# EAGLE design pneumatic-reg - 40PC Sensor (EAGLE 7.6.0)
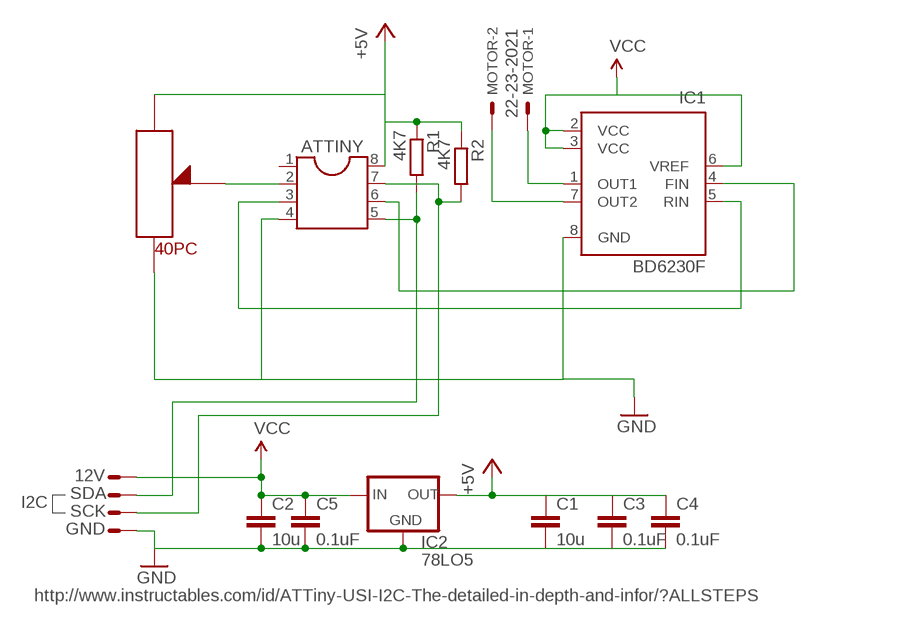
[diagram p0: schematic, sheet 1]

## Parts
ATTINY  DIL8  [DIL08]
C1  10u  C-EUC1206  [C1206]
C2  10u  C-EUC1206  [C1206]
C3  0.1uF  C-EUC1206  [C1206]
C4  0.1uF  C-EUC1206  [C1206]
C5  0.1uF  C-EUC1206  [C1206]
IC1  BD6230F  [SOP8]
IC2  78LO5  78LXX  [78LXX]
MOTOR  22-23-2021  [22-23-2021]
R1  4K7  R-EU_M0805  [M0805]
R2  4K7  R-EU_M0805  [M0805]
U$1  40PC  [40PC]
X2  22-23-2041  [22-23-2041]

## Nets
+5V: ATTINY.8 C1.1 C3.1 C4.1 IC2.OUT R1.1 R2.1 U$1.PIN1
D0: ATTINY.3 IC1.5(RIN)
D1: ATTINY.6 IC1.4(FIN)
GND: ATTINY.4 C1.2 C2.2 C3.2 C4.2 C5.2 IC1.8(GND) IC2.GND U$1.PIN2 X2.1
N$1: ATTINY.2 U$1.PIN3
N$3: ATTINY.5 R1.2 X2.3
N$4: IC1.7(OUT2) MOTOR.2
N$5: IC1.1(OUT1) MOTOR.1
N$9: ATTINY.7 R2.2 X2.2
VCC: C2.1 C5.1 IC1.2(VCC) IC1.3(VCC) IC1.6(VREF) IC2.IN X2.4
Unconnected: ATTINY.1

## Notes on the sheet
- 12V
- SDA
- I2C
- SCK
- GND
- http://www.instructables.com/id/ATTiny-USI-I2C-The-detailed-in-depth-and-infor/?ALLSTEPS

## Library data of the parts
ATTINY = ic-package:DIL8: Dual In Line / Socket
C1-C5 = rcl:C-EU: CAPACITOR, European symbol
IC1 = rohm:BD623*F: H-bridge driver for brush motors Source: http://www.rohm.com/products/databook/motor/pdf/bd623x_series-e.pdf; MPN: BD6230F-E2; OC_FARNELL: 1716264; OC_NEWARK: 15R0529
IC2 = v-reg - Copy:78LXX: VOLTAGE REGULATOR
MOTOR = con-molex:22-23-2021: .100" (2.54mm) Center Header - 2 Pin; MF: MOLEX; MPN: 22-23-2021; OC_FARNELL: 1462926; OC_NEWARK: 25C3832
R1 R2 = rcl:R-EU_: RESISTOR, European symbol
U$1 = 40pc:40PC: Pressure sensor (up to 690kPa). 5V input
X2 = con-molex:22-23-2041: .100" (2.54mm) Center Header - 4 Pin; MF: MOLEX; MPN: 22-23-2041; OC_FARNELL: 1462920; OC_NEWARK: 38C0355

## Board
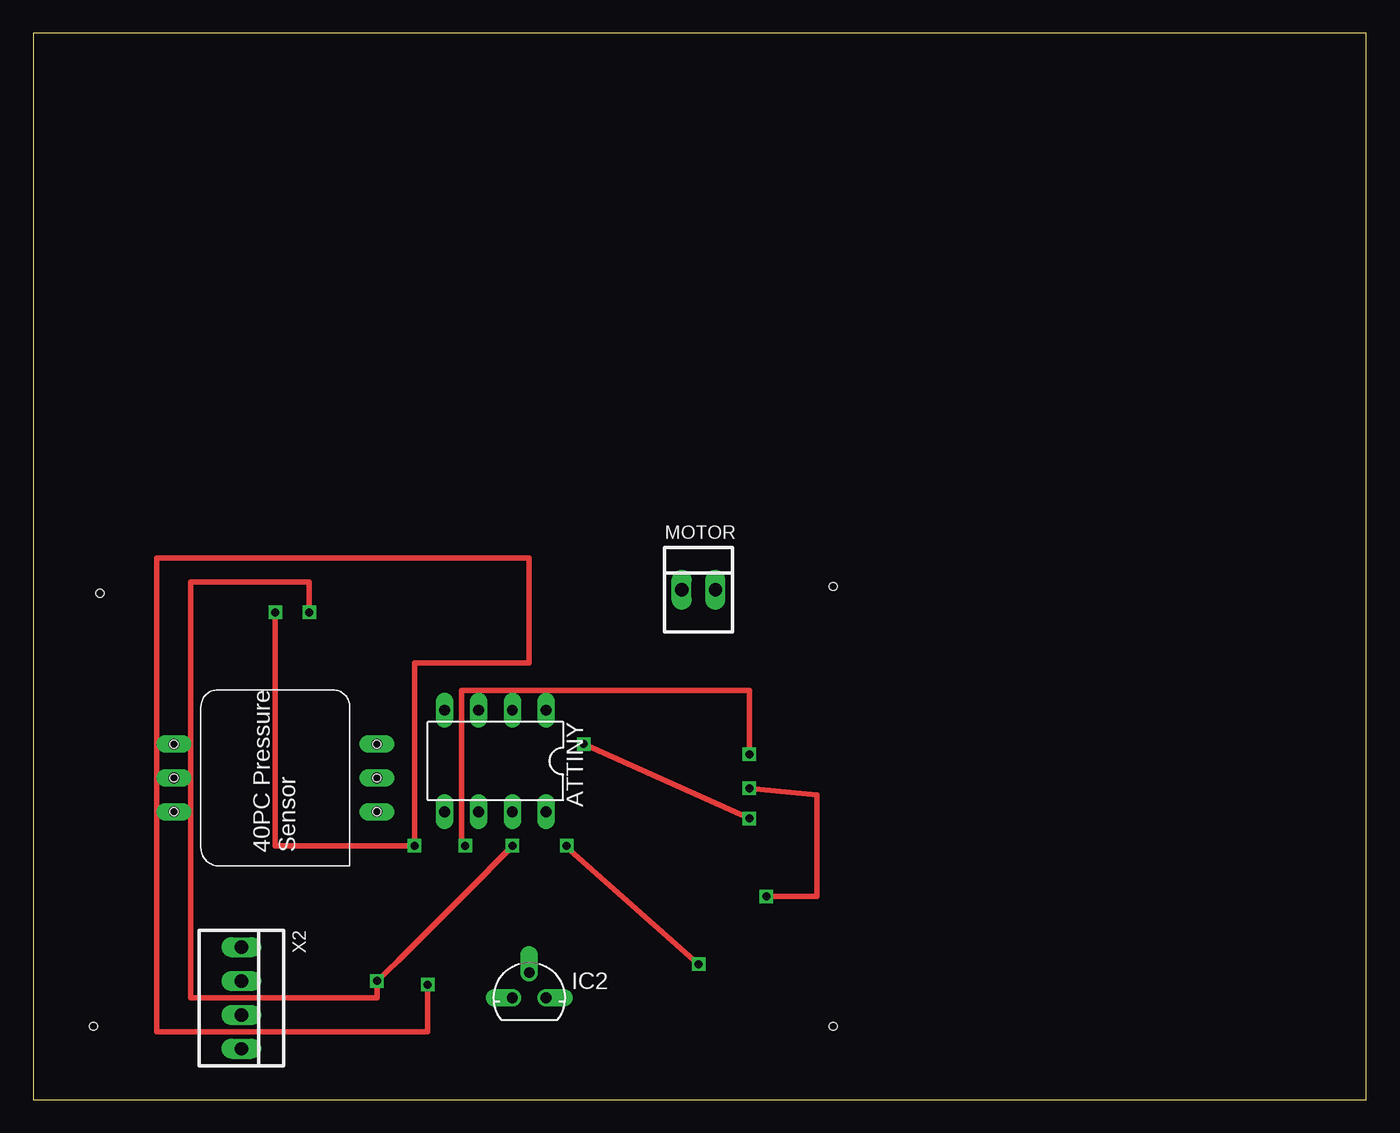
[diagram p1: board, top side]
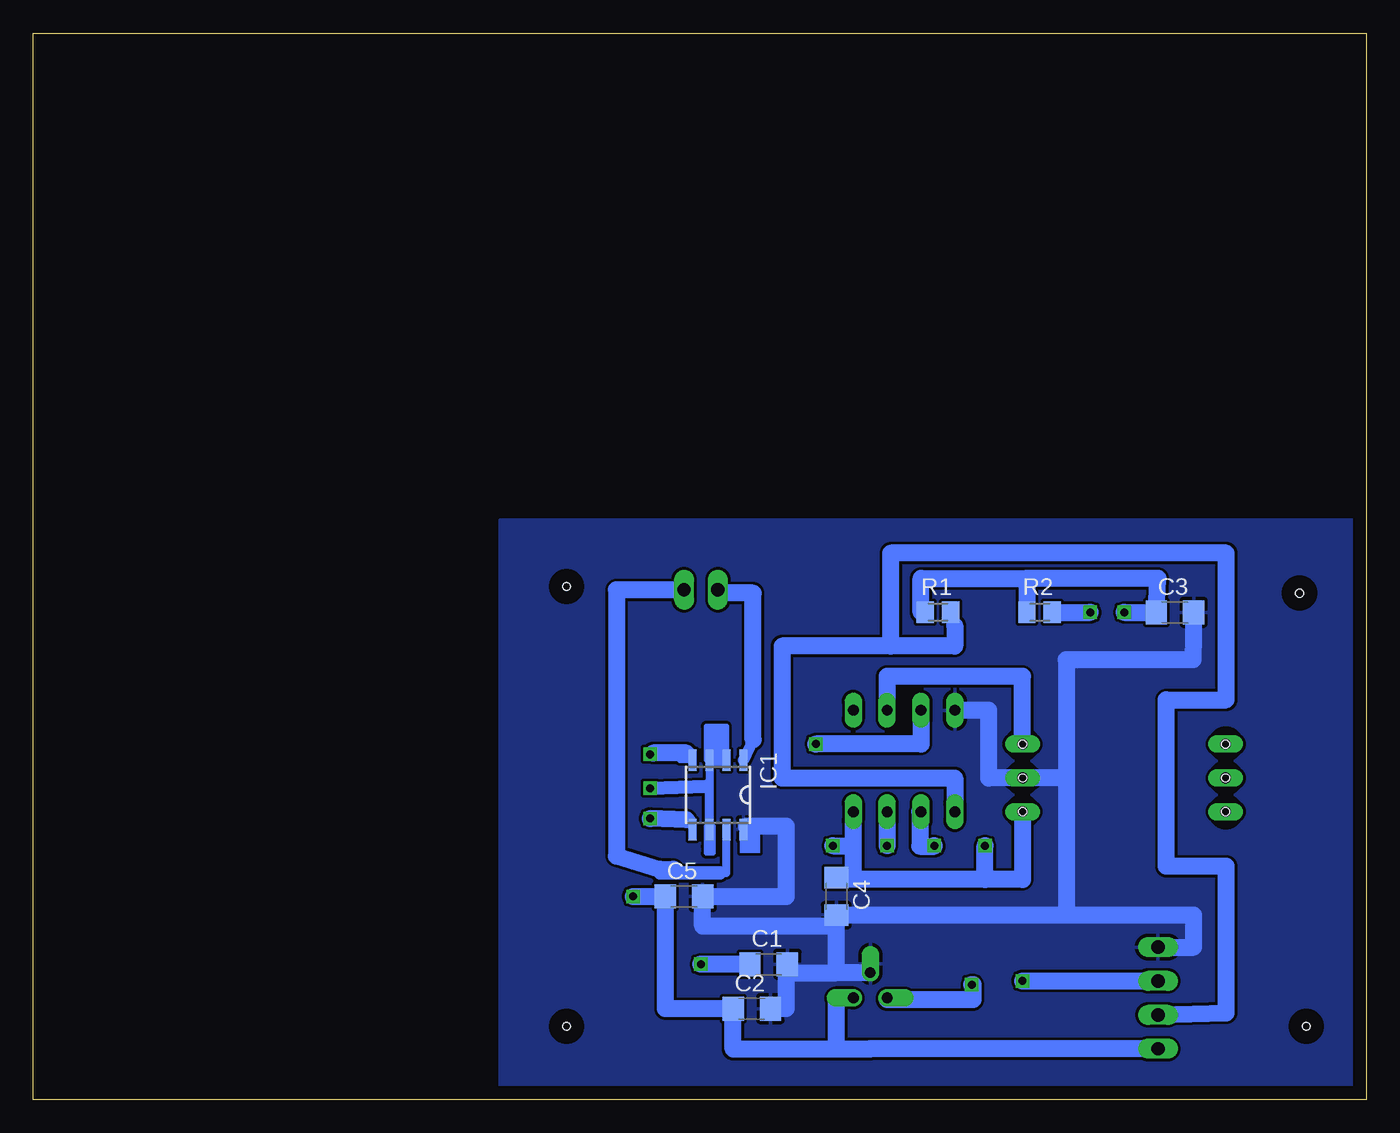
[diagram p2: board, bottom side, seen from below]

Size 100 x 80 mm. Coordinates in mm from the lower left corner, seen from the top.
Outline: 0,0 100,0 100,80 0,80 0,0
Copper layers (1*16): Top 0.035mm / dielectric 1.5mm / Bottom 0.035mm
Design rules "default": minimum track width 10mil, minimum drill 24mil, track to track 8mil, track to pad 8mil, pad to pad 8mil, via to via 8mil, smd to smd 8mil, copper to edge 40mil, drill to drill 8mil, minimum pad ring 10mil, minimum via ring 8mil, stop-mask expansion 4mil, vias tented up to drill 0mil, thermal gap 10mil
Holes 0.6 mm at 60,38.5 60,5.5 5,38 4.5,5.5

### Footprints (pad centres in the part's own frame; a part is rotated, then mirrored left to right if it is on the bottom)
DIL08 = drill 0.813 long: 1 -3.81,-3.81; 2 -1.27,-3.81; 3 1.27,-3.81; 4 3.81,-3.81; 5 3.81,3.81; 6 1.27,3.81; 7 -1.27,3.81; 8 -3.81,3.81
C1206 = smd 1.6 x 1.8: 1 -1.4,0; 2 1.4,0
SOP8 = smd 0.6 x 1.6: 1 -1.905,-2.6; 2 -0.635,-2.6; 3 0.635,-2.6; 4 1.905,-2.6; 5 1.905,2.6; 6 0.635,2.6; 7 -0.635,2.6; 8 -1.905,2.6
78LXX = drill 0.813 offset: GND 0,1.905; IN 1.27,0; OUT -1.27,0
22-23-2021 = drill 1 long: 1 -1.27,0; 2 1.27,0
M0805 = smd 1.3 x 1.6: 1 -0.95,0; 2 0.95,0
40PC = drill 0.8 long: P$4 -2.54,7.62; P$5 0,7.62; P$6 2.54,7.62; PIN1 -2.54,-7.62; PIN2 0,-7.62; PIN3 2.54,-7.62 | hole 0.6: 0,7.62; 2.54,7.62; -2.54,7.62; -2.54,-7.62; 2.54,-7.62; 0,-7.62
22-23-2041 = drill 1 long: 1 -3.81,0; 2 -1.27,0; 3 1.27,0; 4 3.81,0

### Placement (x,y rotation side)
ATTINY  34.67,25.4 180 top
C1  44.83,10.16 0 bottom
C2  46.1,6.81 0 bottom
C3  14.35,36.56 0 bottom
C4  39.75,15.24 270 bottom
C5  51.18,15.24 0 bottom
IC1  48.64,22.86 180 bottom
IC2  37.21,7.62 0 top
MOTOR  49.91,38.25 0 top
R1  32.13,36.56 0 bottom
R2  24.51,36.56 0 bottom
U$1  18.16,24.13 90 top
X2  15.62,7.62 270 top

### Tracks (layer width: path | path; a pad name or v marks a point on that pad's centre or on a via)
+5V  (via drill 0.6, 0.6 pad 0.61)
  Top 0.406: v18.16,36.56 18.16,19.05 v28.59,19.05 28.59,32.75 37.21,32.75 37.21,40.64 9.27,40.64 9.27,5.08 29.59,5.08 v29.59,8.62 | v49.91,10.16 39.91,19.05 v40.02,19.05
  Bottom 0.406: 38.48,16.64 C4.1 39.75,16.51 | R1.1 33.4,36.56
  Bottom 1.27: 38.48,16.64 38.48,19.05 | 38.48,19.05 ATTINY.8 | 28.59,16.51 39.75,16.51 | 25.46,39.1 15.62,39.1 C3.1 v18.16,36.56 | 25.46,39.1 R2.1 | 33.4,36.56 33.4,39.1 25.46,39.1 | U$1.PIN1 25.78,16.51 28.59,16.51 | 28.59,16.51 v28.59,19.05 | C1.1 v49.91,10.16 | v40.02,19.05 38.48,19.05 | v29.59,8.62 29.5,8.62 29.5,7.5 35.94,7.5 IC2.OUT
D0  (via drill 0.6)
  Top 0.406: v41.29,26.67 v53.72,21.09
  Bottom 0.406: IC1.5 50.55,21.09 51,21
  Bottom 1.27: ATTINY.3 33.4,26.67 v41.29,26.67 | 51,21 v53.72,21.09
D1  (via drill 0.6)
  Top 0.406: v53.72,25.9 53.72,30.71 32.13,30.71 32.13,19.05 v32.4,19.05
  Bottom 0.406: IC1.4 51.5,25.46 51.5,25.5 51,26 | 53.5,26 v53.72,25.9
  Bottom 1.27: 51,26 53.5,26 | ATTINY.6 33.5,21.59 33.5,19 32.4,19 v32.4,19.05
GND
  Bottom 0.406: 43.43,9.53 C1.2
  Bottom 0.61: 46.5,20.5 IC1.8
  Bottom 1.27: 22.47,13.84 12.95,13.84 12.95,11.43 X2.1 | ATTINY.4 28.32,29.21 28.32,24.13 U$1.PIN2 22.5,24.13 | IC2.GND 39.75,9.53 | C2.2 43.52,6.81 43.52,9.53 43.43,9.53 39.75,9.53 | 39.75,9.53 C4.2 | C4.2 22.47,13.84 | 22.47,13.84 22.47,24.13 22.5,24.13 | C3.2 13,33 22.5,33 22.5,24.13 | C4.2 40,13.84 40,13 49.78,13 C5.2 43.5,15.24 43.5,20.5 46.5,20.5
  pour Bottom: 0.5,43.5 65,43.5 65,0.5 0.5,0.5
N$1
  Bottom 1.27: U$1.PIN3 25.78,31.75 35.94,31.75 ATTINY.2
N$2
  Bottom 0.406: 48,25.5 48,28 49.5,28 49.5,25.5
N$3
  Bottom 0.406: R1.2 30.86,35.56
  Bottom 1.27: 30.86,35.56 30.86,34.02 35.67,34.02 | 35.67,34.02 35.67,41 10.5,41 10.5,30 15,30 15,17.5 10.5,17.5 10.5,6.5 X2.3 | 35.67,34.02 43.83,34.02 43.83,24.13 30.86,24.13 ATTINY.5
N$4
  Bottom 0.406: 48.5,17 48.01,17 | 53,17.28 53,17
  Bottom 0.61: 48.01,17 IC1.7
  Bottom 1.016: 53,17 48.5,17
  Bottom 1.27: MOTOR.2 56.26,38.25 56.26,18.28 53,17.28 52,17.28
N$5
  Bottom 0.406: 48.64,38 MOTOR.1
  Bottom 0.813: 46,27 IC1.1
  Bottom 1.27: 46,27 46,38 48.64,38
N$6
  Bottom 0.406: 49.5,19 49.5,18.5 49,18.5 49,20.5 49.5,20.5 49.5,19
N$9  (via drill 0.6)
  Top 0.406: v20.7,36.56 20.7,38.83 11.81,38.83 11.81,7.62 25.78,7.62 v25.78,8.89 27.36,10.39 32.44,15.47 v35.94,19.05
  Bottom 1.27: ATTINY.7 v35.94,19.05 | v25.78,8.89 X2.2 | R2.2 v20.7,36.56
VCC  (via drill 0.6)
  Top 0.406: v54.99,15.24 58.8,15.24 58.8,22.86 v53.72,23.36
  Bottom 0.406: 39.75,7.62 IC2.IN | IC1.6 49.41,20.26 49.41,23.36 49.5,23.5 | IC1.2 48.5,25.5 | 49,25.5 IC1.3
  Bottom 0.61: IC1.3 IC1.6
  Bottom 1.016: v53.72,23.36 49.5,23.5 | 48.5,25.5 49,25.5
  Bottom 1.27: X2.4 37.21,3.81 | 39.75,7.62 39.75,3.81 37.21,3.81 | 37.21,3.81 37.21,3.77 47.5,3.77 C2.1 52.58,6.81 C5.1 v54.99,15.24
(copper drawn outside any net)
  shapes: Bottom area x3